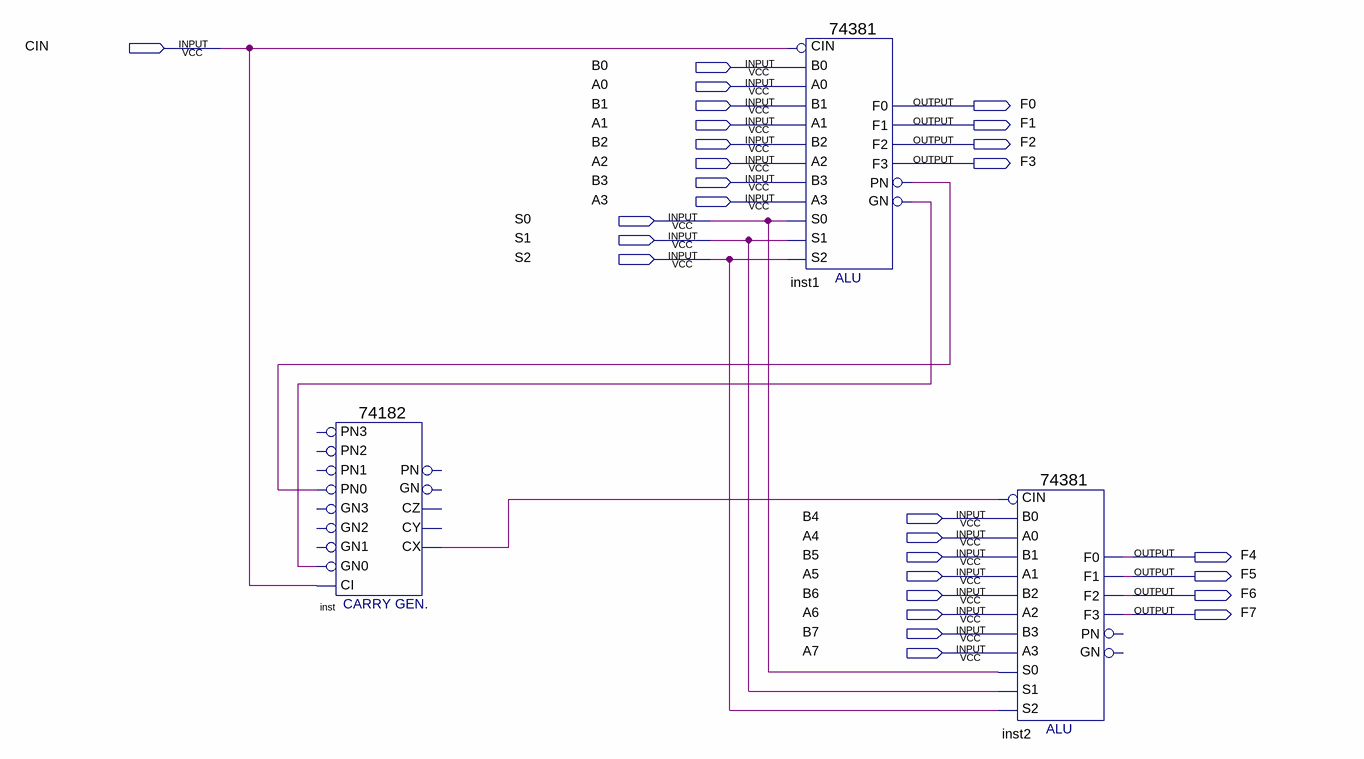
[diagram p0: schematic sheet]
// Quartus schematic a3BBB.bdf as structural Verilog: 3 symbols, 28 pins
module a3BBB (
  input  CIN,
  input  B0,
  input  A0,
  input  B1,
  input  A1,
  input  B2,
  input  A2,
  input  B3,
  input  A3,
  input  S0,
  input  S1,
  input  S2,
  input  B4,
  input  A4,
  input  B5,
  input  A5,
  input  B6,
  input  A6,
  input  B7,
  input  A7,
  output F0,
  output F1,
  output F2,
  output F3,
  output F4,
  output F5,
  output F6,
  output F7
);

  wire inst1_gn, inst1_pn, inst_cx;

  \74182  inst (
    .CI(CIN), .PN0(inst1_pn), .GN0(inst1_gn), .CX(inst_cx));  // open: PN2, GN2, GN3, PN3, PN1, GN1, CY, PN, CZ, GN
  \74381  inst1 (
    .A1(A1), .CIN(CIN), .B1(B1), .A0(A0), .B0(B0), .A3(A3), .A2(A2), .B3(B3), .B2(B2), .S2(S2), .S1(S1),
    .S0(S0), .F0(F0), .F1(F1), .F3(F3), .F2(F2), .GN(inst1_gn), .PN(inst1_pn));
  \74381  inst2 (
    .A1(A5), .CIN(inst_cx), .B1(B5), .A0(A4), .B0(B4), .A3(A7), .A2(A6), .B3(B7), .B2(B6), .S2(S2), .S1(S1),
    .S0(S0), .F0(F4), .F1(F5), .F3(F7), .F2(F6));  // open: GN, PN
endmodule
